# EAGLE design fabisp (EAGLE 5.06)
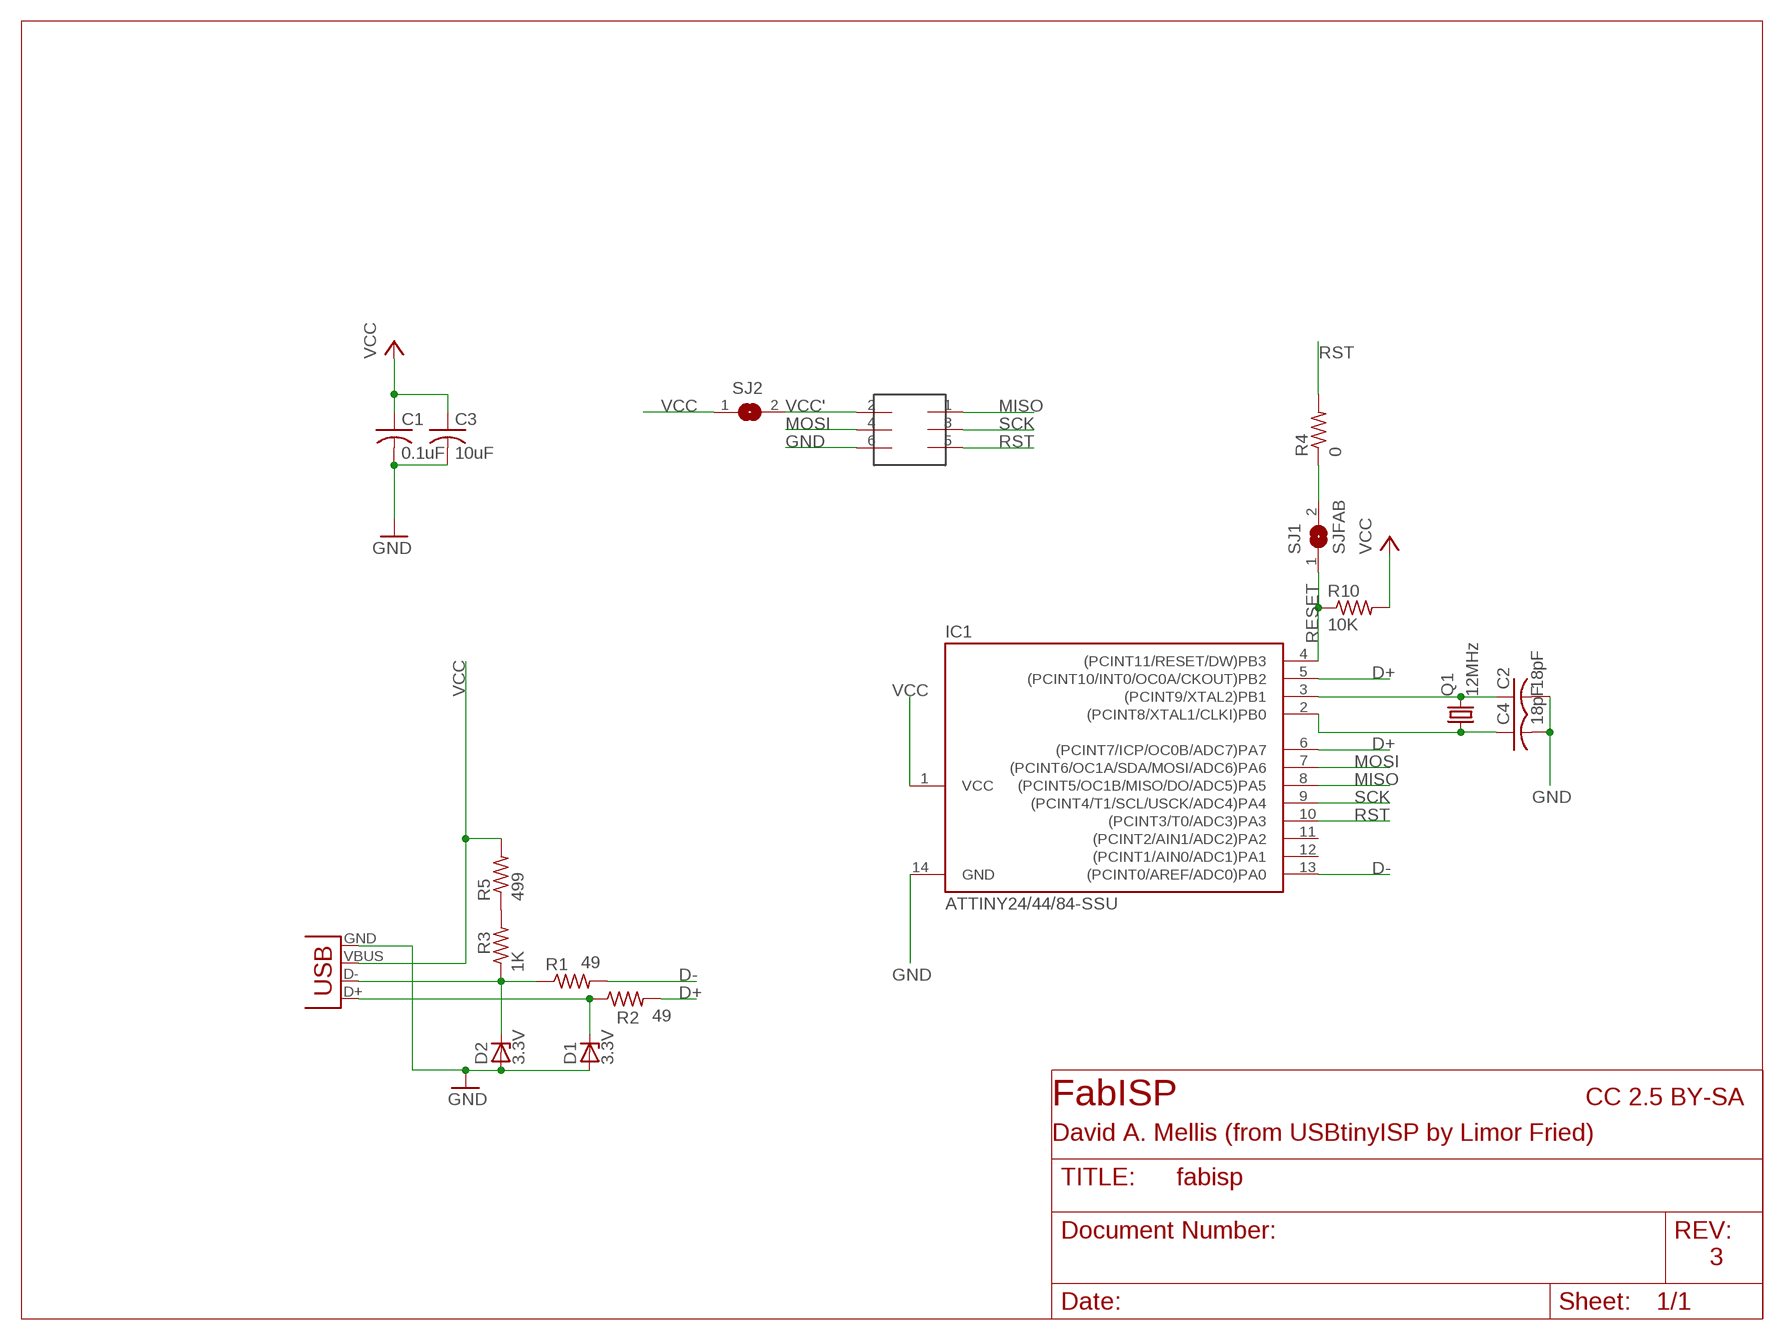
[diagram p0: schematic, sheet 1]

## Parts
C1  0.1uF  C-USC1206  [C1206]
C2  18pF  C-USC1206  [C1206]
C3  10uF  C-USC1206  [C1206]
C4  18pF  C-USC1206  [C1206]
D1  3.3V  ZENER_DIODESOD123  [SOD123]
D2  3.3V  ZENER_DIODESOD123  [SOD123]
IC1  ATTINY24/44/84-SSU  [SOIC14]
Q1  12MHz  CRYSTALHC49UP  [HC49UP]
R1  49  R-US_R1206  [R1206]
R2  49  R-US_R1206  [R1206]
R3  1K  R-US_R1206  [R1206]
R4  0  R-US_R1206  [R1206]
R5  499  R-US_R1206  [R1206]
R10  10K  R-US_R1206  [R1206]
SJ1  SJFAB  [SJFAB]
SJ2  SJFAB  [SJFAB]
U$1  2X3HEADER  [2X3_SMD]
X1  USB_MINIB  [USB_MINIB]

## Nets
D+: IC1.5((PCINT10/INT0/OC0A/CKOUT)PB2) IC1.6((PCINT7/ICP/OC0B/ADC7)PA7) R2.2
D-: IC1.13((PCINT0/AREF/ADC0)PA0) R1.2
GND: C1.2 C2.2 C3.2 C4.2 D1.ANODE D2.ANODE IC1.14(GND) U$1.6 X1.GND
MISO: IC1.8((PCINT5/OC1B/MISO/DO/ADC5)PA5) U$1.1
MOSI: IC1.7((PCINT6/OC1A/SDA/MOSI/ADC6)PA6) U$1.4
N$1: D2.CATHODE R1.1 R3.1 X1.D-
N$2: D1.CATHODE R2.1 X1.D+
N$3: R4.1 SJ1.2
N$4: C4.1 IC1.2((PCINT8/XTAL1/CLKI)PB0) Q1.1
N$5: C2.1 IC1.3((PCINT9/XTAL2)PB1) Q1.2
N$6: R3.2 R5.1
RESET: IC1.4((PCINT11/RESET/DW)PB3) R10.1 SJ1.1
RST: IC1.10((PCINT3/T0/ADC3)PA3) R4.2 U$1.5
SCK: IC1.9((PCINT4/T1/SCL/USCK/ADC4)PA4) U$1.3
VCC: C1.1 C3.1 IC1.1(VCC) R5.2 R10.2 SJ2.1 X1.VBUS
VCC': SJ2.2 U$1.2
Unconnected: IC1.11((PCINT2/AIN1/ADC2)PA2) IC1.12((PCINT1/AIN0/ADC1)PA1)

## Notes on the sheet
- FabISP | CC 2.5 BY-SA
- David A. Mellis (from USBtinyISP by Limor Fried)
- 3

## Library data of the parts
C1 = rcl-ez:C-US: CAPACITOR, American symbol
C2-C4 = rcl:C-US: CAPACITOR, American symbol
D1 D2 = ng:ZENER_DIODE: zener diode
IC1 = attiny24_44_84:ATTINY24/44/84
Q1 = crystal:CRYSTAL: CRYSTAL
R1-R3 R10 = rcl-ez:R-US_: RESISTOR, American symbol
R4 R5 = rcl:R-US_: RESISTOR, American symbol
SJ1 SJ2 = mellis:SJFAB
U$1 = mellis:2X3HEADER
X1 = mellis:USB_MINIB

## Board
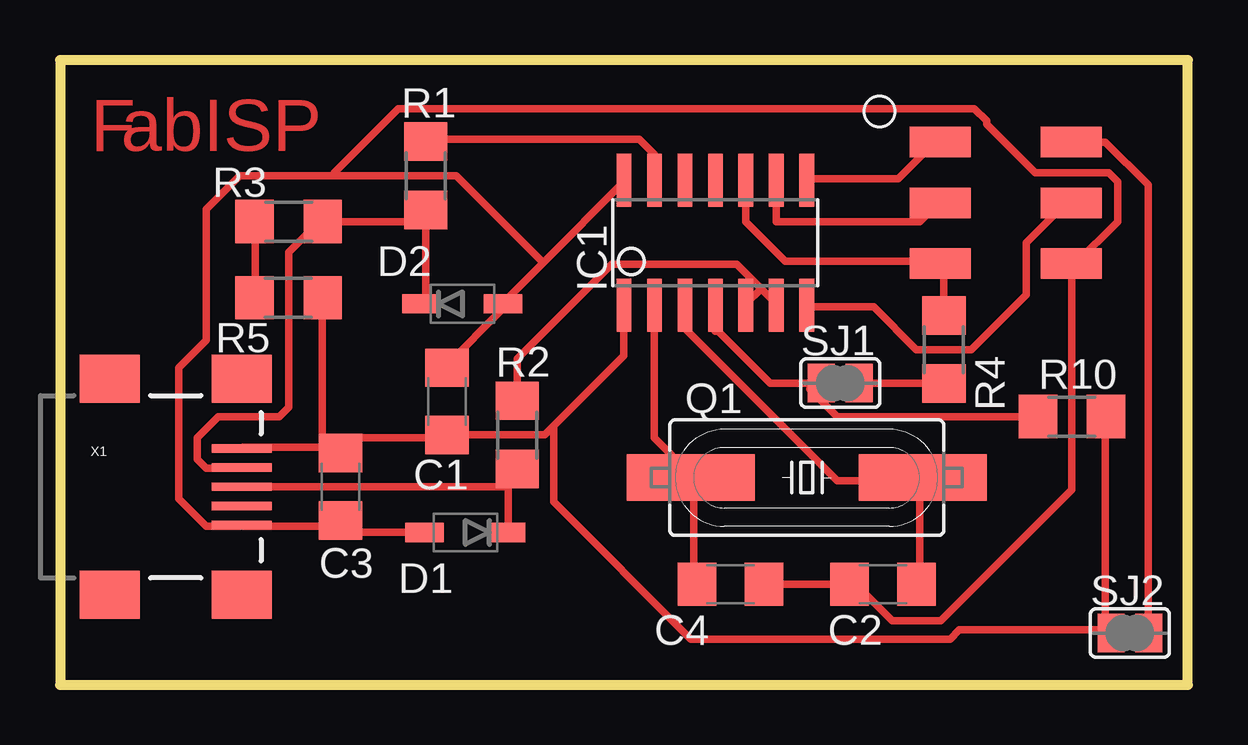
[diagram p1: board, top side]
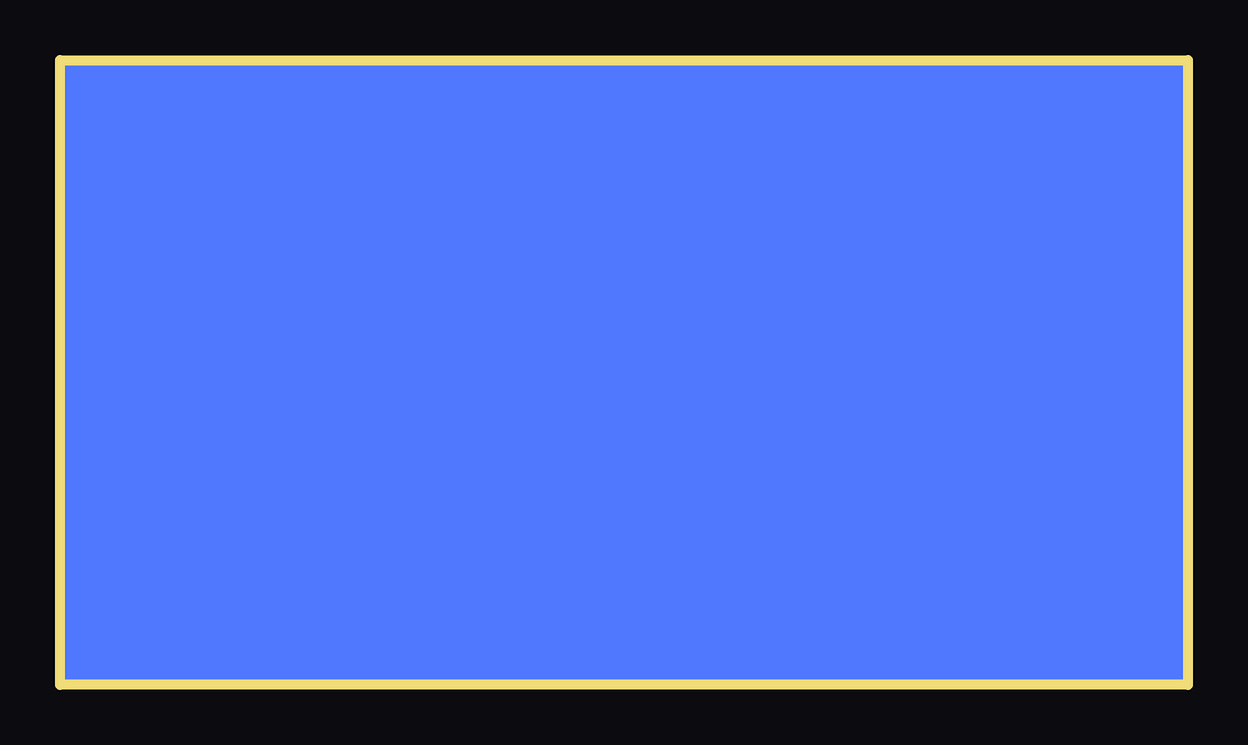
[diagram p2: board, bottom side, seen from below]

Size 46.99 x 26.04 mm. Coordinates in mm from the lower left corner, seen from the top.
Outline: 0,0 46.99,0 46.99,26.04 0,26.04 0,0
Copper layers (1*16): Top 0.035mm / dielectric 1.5mm / Bottom 0.035mm
Design rules "default *": minimum track width 12mil, minimum drill 24mil, track to track 17mil, track to pad 16mil, pad to pad 16mil, via to via 16mil, smd to smd 0mil, copper to edge 17mil, drill to drill 8mil, minimum pad ring 10mil, minimum via ring 8mil, stop-mask expansion 4mil, vias tented up to drill 0mil, thermal gap 10mil

### Footprints (pad centres in the part's own frame; a part is rotated, then mirrored left to right if it is on the bottom)
C1206 = smd 1.6 x 1.8: 1 -1.4,0; 2 1.4,0
SOD123 = smd 1.6 x 0.8: ANODE 1.7,0; CATHODE -1.7,0
SOIC14 = smd 0.61 x 2.21: 1 -3.81,-2.603; 2 -2.54,-2.603; 3 -1.27,-2.603; 4 0,-2.603; 5 1.27,-2.603; 6 2.54,-2.603; 7 3.81,-2.603; 8 3.81,2.603; 9 2.54,2.603; 10 1.27,2.603; 11 0,2.603; 12 -1.27,2.603; 13 -2.54,2.603; 14 -3.81,2.603
HC49UP = smd 5.334 x 1.93: 1 -4.826,0; 2 4.826,0
R1206 = smd 1.6 x 1.803: 1 -1.422,0; 2 1.422,0
SJFAB = smd 1.118 x 1.6: 1 -0.787,0; 2 0.787,0
2X3_SMD = smd 2.54 x 1.27: 1 -2.54,2.54; 2 2.92,2.54; 3 -2.54,0; 4 2.92,0; 5 -2.54,-2.54; 6 2.92,-2.54
USB_MINIB = smd 2.5 x 0.35: D+ 3.77,0; D- 3.77,0.8; GND 3.77,-1.6; ID 3.77,-0.8; VBUS 3.77,1.6 | smd 2.5 x 2: GND@1 -1.73,-4.5; GND@2 -1.73,4.5; GND@3 3.77,4.5; GND@4 3.77,-4.5

### Placement (x,y rotation side)
C1  16.13,11.81 90 top
C2  34.29,4.19 180 top
C3  11.68,8.26 270 top
C4  27.94,4.19 0 top
D1  16.89,6.35 180 top
D2  16.76,15.88 0 top
IC1  27.3,18.41 0 top
Q1  31.11,8.64 0 top
R1  15.24,21.21 90 top
R2  19.05,10.41 90 top
R3  9.53,19.3 180 top
R4  36.83,13.97 90 top
R5  9.53,16.13 0 top
R10  42.16,11.18 0 top
SJ1  32.51,12.57 0 top
SJ2  44.58,2.16 0 top
U$1  39.22,20.09 0 top
X1  3.81,8.26 0 top

### Tracks (layer width: path | path; a pad name or v marks a point on that pad's centre or on a via)
D+
  Top 0.305: 29.21,16.51 29.84,15.88 IC1.6 | 29.21,16.51 28.19,17.53 22.99,17.53 19.05,13.59 R2.2 | 29.21,16.51 28.57,15.88 IC1.5
D-
  Top 0.305: 24.77,21.97 IC1.13 24.77,22.1 24.13,22.73 15.24,22.73 R1.2
GND
  Top 0.305: D1.ANODE 12.06,6.35 11.68,6.73 C3.2 11.68,6.6 7.62,6.6 X1.GND 7.49,6.6 6.1,6.6 4.95,7.75 4.95,13.21 6.1,14.35 6.1,19.81 7.49,21.21 11.43,21.21 | C1.2 16.13,13.34 18.41,15.62 18.41,15.88 D2.ANODE 18.54,16 20.13,17.59 | C2.2 C4.2 | C2.2 33.02,4.19 | C2.2 33.15,4.19 34.67,2.67 36.7,2.67 42.16,8.13 42.16,17.53 U$1.6 42.29,17.53 44.07,19.3 44.07,20.95 43.69,21.34 40.64,21.34 38.61,23.37 38.61,23.5 38.1,24 14.1,24 11.43,21.34 11.43,21.21 | 20.13,17.59 23.5,20.95 IC1.14 | 11.43,21.21 16.51,21.21 20.13,17.59
MISO
  Top 0.305: 31.11,21.08 IC1.8 31.24,21.08 34.92,21.08 36.58,22.73 U$1.1
MOSI
  Top 0.305: IC1.7 31.11,15.75 33.91,15.75 35.69,13.97 37.97,13.97 40.26,16.26 40.26,18.41 42.04,20.19 U$1.4
N$1
  Top 0.305: 15.24,16.13 15.11,16 D2.CATHODE 15.24,16.26 R1.1 15.11,19.3 R3.1 10.79,19.3 9.53,18.03 9.53,11.56 9.14,11.18 6.6,11.18 5.71,10.29 5.71,9.4 6.1,9.02 7.49,9.02 X1.D-
N$2
  Top 0.305: D1.CATHODE 18.67,6.35 18.67,8.51 19.05,8.89 R2.1 18.54,8.26 X1.D+
N$3
  Top 0.305: SJ1.2 36.83,12.57 R4.1
N$4
  Top 0.305: C4.1 26.42,4.19 26.42,8.51 Q1.1 26.29,8.76 24.77,10.29 IC1.2
N$5
  Top 0.305: C2.1 35.81,4.19 35.81,8.51 Q1.2 35.69,8.51 32.38,8.51 26.04,14.86 IC1.3
N$6
  Top 0.305: R5.1 8.13,16.13 8.13,19.3 R3.2
RESET
  Top 0.305: IC1.4 27.3,14.86 | IC1.4 27.3,14.73 | SJ1.1 29.59,12.57 27.43,14.73 IC1.4 | SJ1.1 31.24,12.45 | SJ1.1 31.24,12.32 32.38,11.18 R10.1
RST
  Top 0.305: R4.2 36.83,17.4 36.7,17.53 U$1.5 36.58,17.65 30.23,17.65 28.57,19.3 IC1.10
SCK
  Top 0.305: U$1.3 36.58,20.07 35.81,19.3 31.11,19.3 30.61,19.3 29.84,19.3 IC1.9
VCC
  Top 0.305: X1.VBUS 7.62,9.91 11.56,9.91 C3.1 | SJ2.1 43.69,2.16 | 43.56,11.43 R10.2 43.56,11.05 43.56,2.41 SJ2.1 | SJ2.1 43.56,2.29 | C3.1 11.68,9.91 12.06,10.29 16.13,10.29 C1.1 16.26,10.41 20.19,10.41 20.51,10.73 | 20.51,10.73 23.5,13.72 IC1.1 | SJ2.1 43.43,2.29 37.47,2.29 37.08,1.91 26.29,1.91 20.57,7.62 20.57,10.67 20.51,10.73 | R5.2 10.92,16.13 10.92,10.03 C3.1
VCC'
  Top 0.305: U$1.2 42.16,22.61 | U$1.2 42.29,22.61 | SJ2.2 45.34,2.16 45.34,20.83 43.56,22.61 42.42,22.61 U$1.2
(copper drawn outside any net)
  shapes: Bottom area x1

### Text on the board
Top: F | abISP